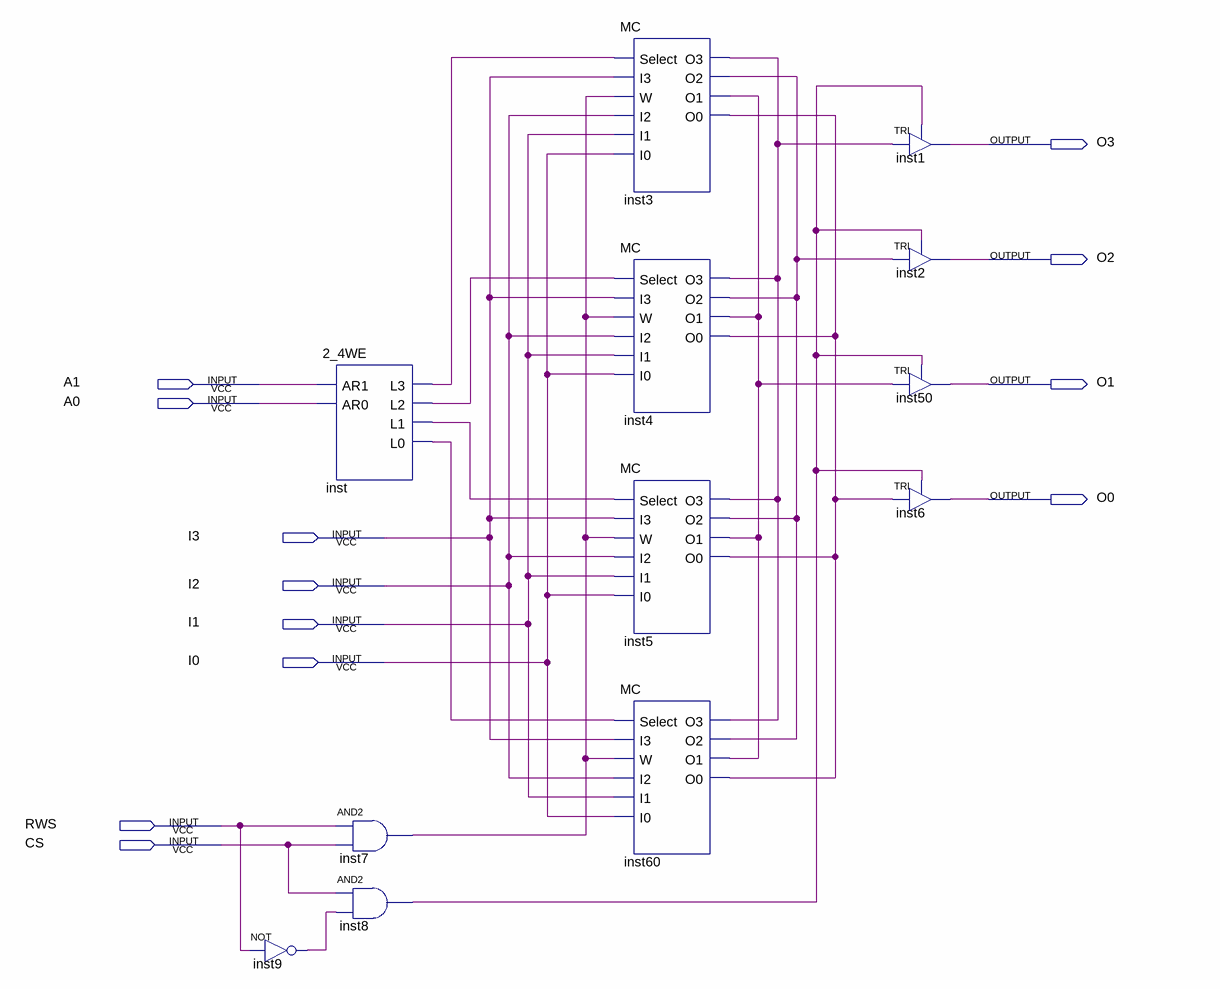
[diagram p0: schematic sheet]
// Quartus schematic RAM.bdf as structural Verilog: 12 symbols, 12 pins
module RAM (
  input  A1,
  input  A0,
  input  I3,
  input  I2,
  input  I1,
  input  I0,
  input  RWS,
  input  CS,
  output O3,
  output O2,
  output O1,
  output O0
);

  wire inst3_o0, inst3_o1, inst3_o2, inst3_o3, inst7_out, inst8_out, inst9_out, inst_l0, inst_l1, inst_l2,
       inst_l3;

  not inst9 (inst9_out, RWS);
  \2_4WE  inst (.AR1(A1), .AR0(A0), .L3(inst_l3), .L2(inst_l2), .L1(inst_l1), .L0(inst_l0));
  and inst7 (inst7_out, RWS, CS);
  and inst8 (inst8_out, CS, inst9_out);
  MC inst3 (
    .Select(inst_l3), .I3(I3), .W(inst7_out), .I2(I2), .I1(I1), .I0(I0), .O3(inst3_o3), .O2(inst3_o2),
    .O1(inst3_o1), .O0(inst3_o0));
  MC inst4 (
    .Select(inst_l2), .I3(I3), .W(inst7_out), .I2(I2), .I1(I1), .I0(I0), .O3(inst3_o3), .O2(inst3_o2),
    .O1(inst3_o1), .O0(inst3_o0));
  MC inst5 (
    .Select(inst_l1), .I3(I3), .W(inst7_out), .I2(I2), .I1(I1), .I0(I0), .O3(inst3_o3), .O2(inst3_o2),
    .O1(inst3_o1), .O0(inst3_o0));
  MC inst60 (
    .Select(inst_l0), .I3(I3), .W(inst7_out), .I2(I2), .I1(I1), .I0(I0), .O3(inst3_o3), .O2(inst3_o2),
    .O1(inst3_o1), .O0(inst3_o0));
  TRI inst1 (.IN(inst3_o3), .OE(inst8_out), .OUT(O3));
  TRI inst2 (.IN(inst3_o2), .OE(inst8_out), .OUT(O2));
  TRI inst50 (.IN(inst3_o1), .OE(inst8_out), .OUT(O1));
  TRI inst6 (.IN(inst3_o0), .OE(inst8_out), .OUT(O0));
endmodule
